# EAGLE design DCCShield (EAGLE 8.3.1)
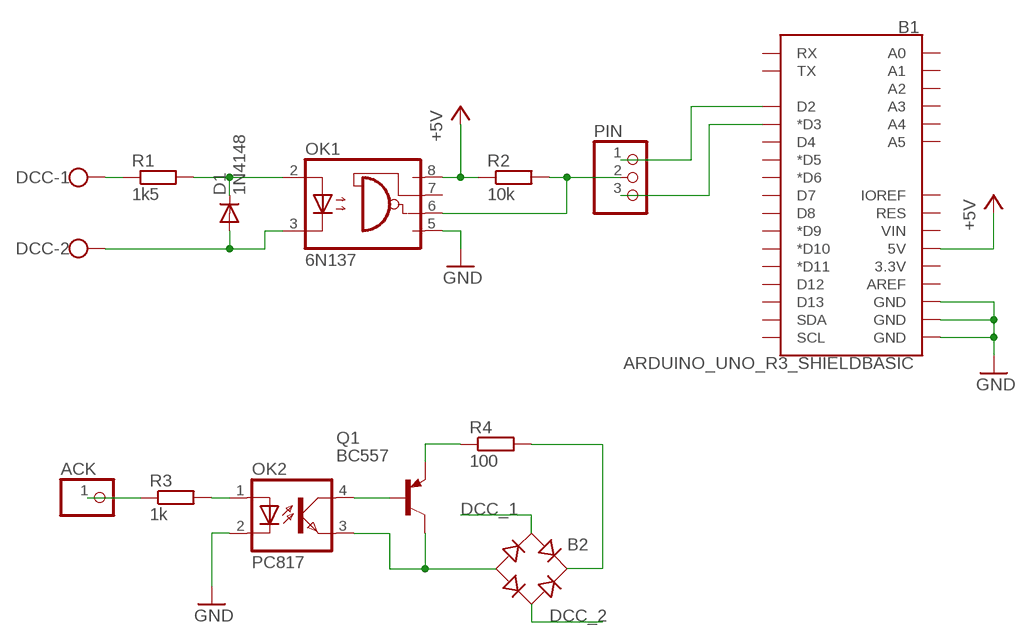
[diagram p0: schematic, sheet 1]

## Parts
ACK  PINHD-1X1  [1X01]
B1  ARDUINO_UNO_R3_SHIELDBASIC  [UNO_R3_SHIELD]
B2  RB1A  [RB1A]
D1  1N4148  1N4148DO35-10  [DO35-10]
DCC  W237-102  [W237-102]
OK1  6N137  [DIL08]
OK2  PC817  [DIL04]
PIN  PINHD-1X3  [1X03]
Q1  BC557  [TO92]
R1  1k5  R-EU_0207/10  [0207/10]
R2  10k  R-EU_0207/10  [0207/10]
R3  1k  R-EU_0207/10  [0207/10]
R4  100  R-EU_0207/10  [0207/10]

## Nets
+5V: B1.5V OK1.8(VCC) R2.1
DCC_1: B2.AC1 DCC.1 R1.1
DCC_2: B2.AC2 D1.A DCC.2 OK1.3(C)
GND: B1.GND@0(GND) B1.GND@1(GND) B1.GND@2(GND) OK1.5(GND) OK2.2(C)
N$1: B2.- OK2.3(EMIT) Q1.3(C)
N$2: D1.C OK1.2(A) R1.2
N$4: ACK.1 R3.1
N$5: OK1.6(VO) PIN.2 R2.2
N$6: B1.D2 PIN.1
N$7: B1.D3(*D3) PIN.3
N$8: OK2.1(A) R3.2
N$9: OK2.4(COL) Q1.2(B)
N$10: Q1.1(E) R4.1
N$11: B2.+ R4.2
Unconnected: B1.3.3V B1.A0 B1.A1 B1.A2 B1.A3 B1.A4 B1.A5 B1.AREF B1.D4 B1.D5(*D5) B1.D6(*D6) B1.D7 B1.D8 B1.D9(*D9) B1.D10(*D10) B1.D11(*D11) B1.D12 B1.D13 B1.IOREF B1.RES B1.RX B1.SCL B1.SDA B1.TX B1.VIN OK1.7(VE)

## Library data of the parts
ACK = pinhead:PINHD-1X1: PIN HEADER
B1 = SparkFun-Boards:ARDUINO_UNO_R3_SHIELD: Arduino R3 Shield Footprint Shield form compatible with the Arduino Uno R3. SparkFun Products: MG2639 Cellular Shield <https://www.sparkfun.com/products/13120> MIDI Shield <https://www.sparkfun.com/products/12898> R3 Stackable Headers Kit <https://www.sparkfun.com/products/11417>
B2 = rectifier:RB1A: RECTIFIER 1 A
D1 = diode:1N4148: DIODE high speed (Philips)
DCC = con-wago-500:W237-102: WAGO SCREW CLAMP; MPN: 237-102; OC_FARNELL: unknown; OC_NEWARK: 70K9898
OK1 = optocoupler:6N137: MOTOROLA OPTO COUPLER; MPN: 6N137; OC_FARNELL: 1328376; OC_NEWARK: 52M1895
OK2 = optocoupler:PC817: SHARP OPTO COUPLER; MPN: PC817X4J000F; OC_FARNELL: 9707727; OC_NEWARK: 97K7059
PIN = pinhead:PINHD-1X3: PIN HEADER
Q1 = transistor-pnp:BC557: PNP Transistor
R1-R4 = rcl:R-EU_: RESISTOR, European symbol

## Board
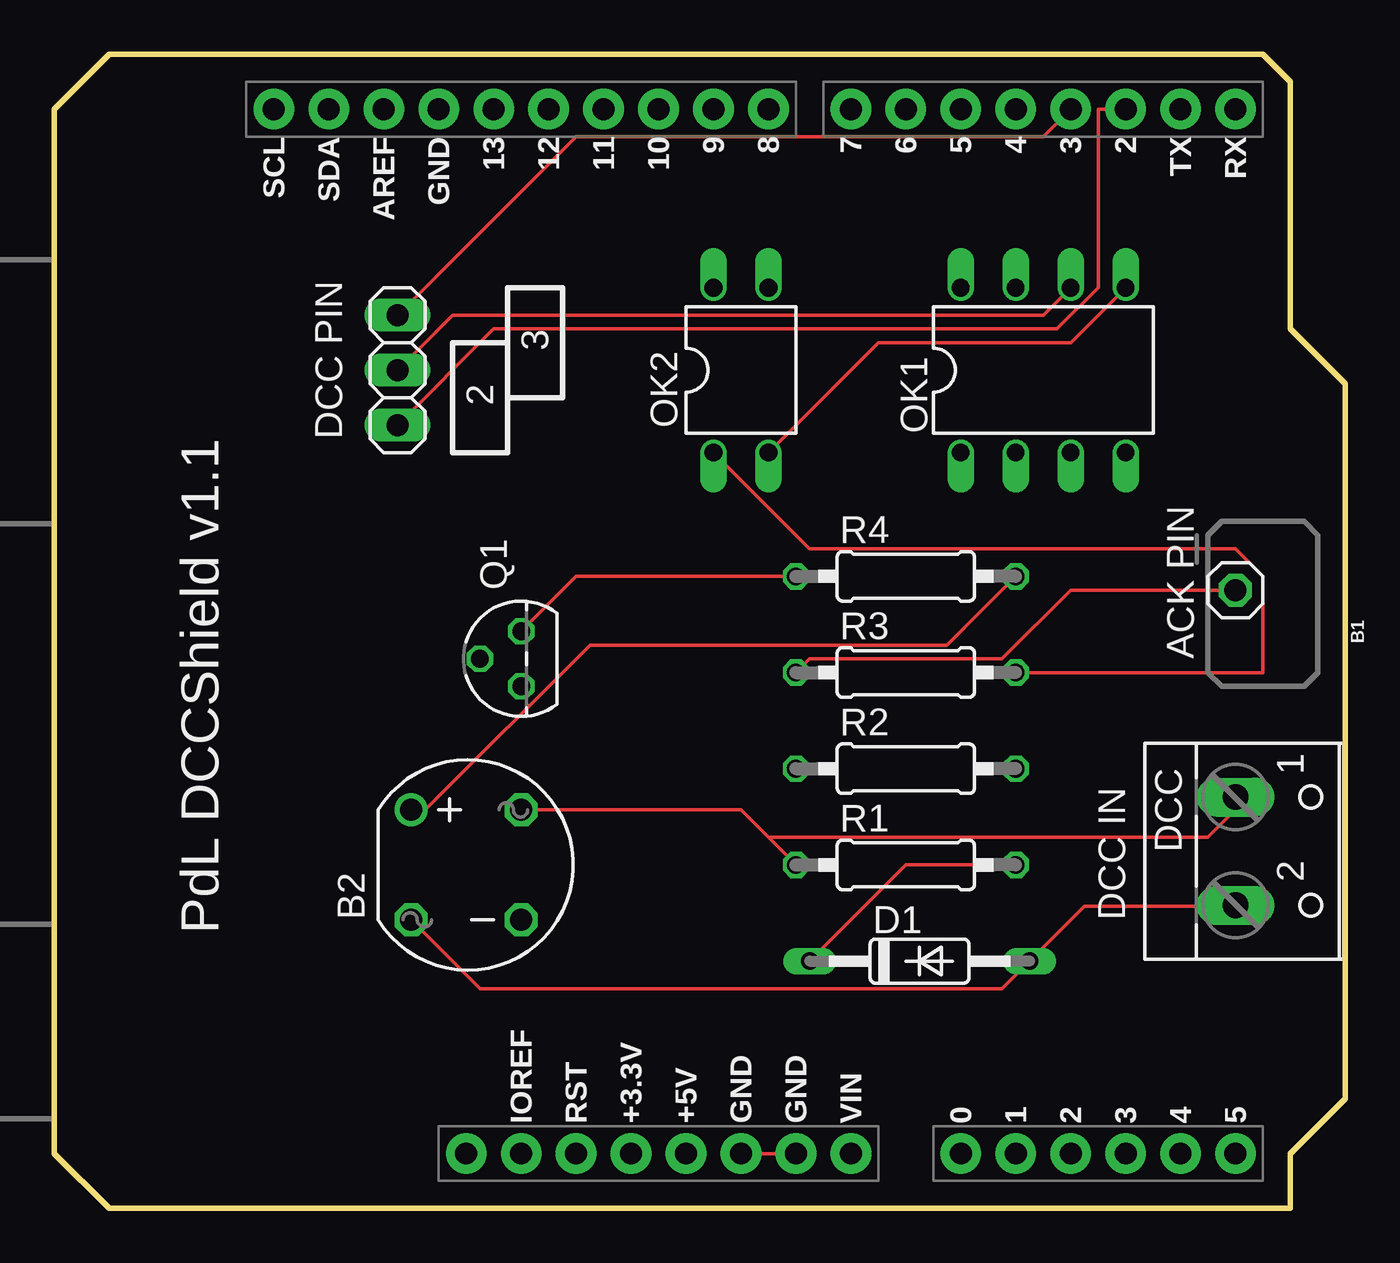
[diagram p1: board, top side]
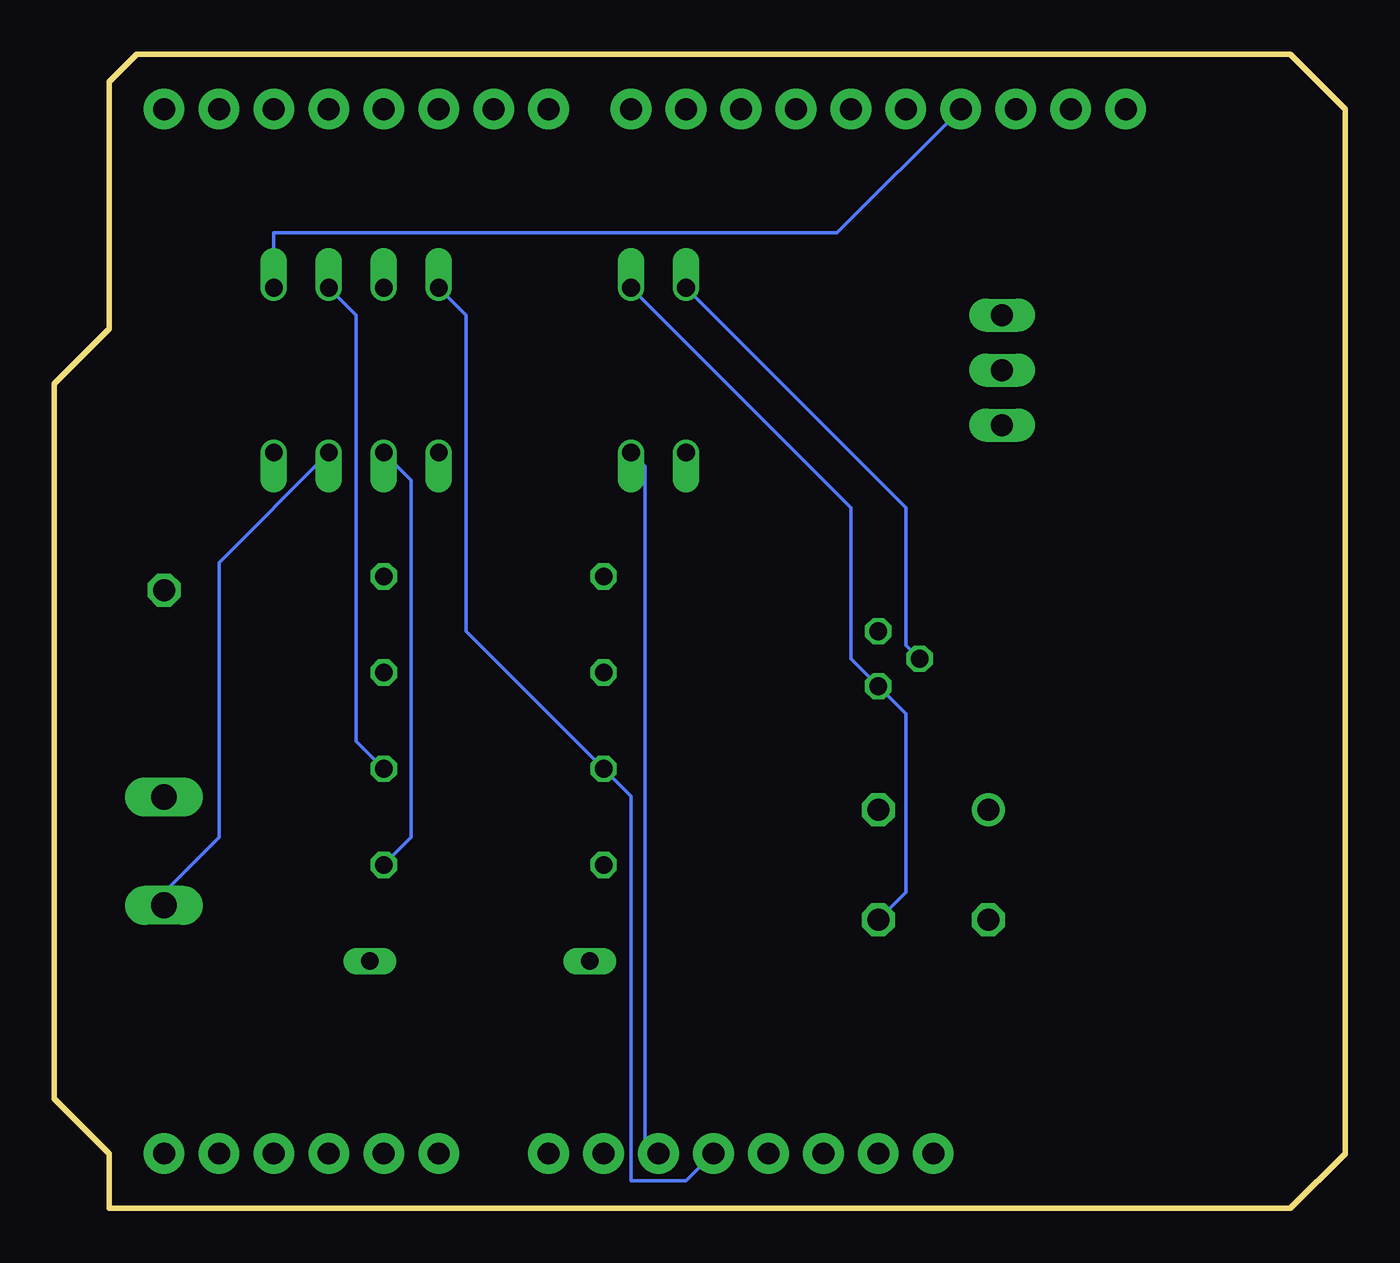
[diagram p2: board, bottom side, seen from below]

Size 59.69 x 53.34 mm. Coordinates in mm from the lower left corner, seen from the top.
Outline: 0,2.54 0,50.8 2.54,53.34 55.88,53.34 57.15,52.07 57.15,40.64 59.69,38.1 59.69,5.08 57.15,2.54 57.15,0 2.54,0 0,2.54
Copper layers (1*16): Top 0.035mm / dielectric 1.6mm / Bottom 0.035mm
Design rules "Elecrow_2-layer_PCB_eagle_rule": minimum track width 6mil, minimum drill 12mil, track to track 6mil, track to pad 8mil, pad to pad 12mil, via to via 12mil, smd to smd 0mil, copper to edge 20mil, drill to drill 10mil, minimum pad ring 6mil, minimum via ring 6mil, stop-mask expansion 0mil, vias tented up to drill 100mil, thermal gap 10mil

### Footprints (pad centres in the part's own frame; a part is rotated, then mirrored left to right if it is on the bottom)
1X01 = drill 1.016 octagon: 1 0,0
UNO_R3_SHIELD = drill 1.016 pad 1.88: 3.3V 24.13,-2.54; 5V 24.13,0; A0 24.13,12.7; A1 24.13,15.24; A2 24.13,17.78; A3 24.13,20.32; A4 24.13,22.86; A5 24.13,25.4; AREF -24.13,-13.97; D2 -24.13,20.32; D3 -24.13,17.78; D4 -24.13,15.24; D5 -24.13,12.7; D6 -24.13,10.16; D7 -24.13,7.62; D8 -24.13,3.81; D9 -24.13,1.27; D10 -24.13,-1.27; D11 -24.13,-3.81; D12 -24.13,-6.35; D13 -24.13,-8.89; GND@0 24.13,2.54; GND@1 24.13,5.08; GND@2 -24.13,-11.43; IOREF 24.13,-7.62; NC 24.13,-10.16; RES 24.13,-5.08; RX -24.13,25.4; SCL -24.13,-19.05; SDA -24.13,-16.51; TX -24.13,22.86; VIN 24.13,7.62
RB1A = drill 1.016: + -2.54,2.54 | drill 1.016 octagon: - 2.54,-2.54; AC1 2.54,2.54; AC2 -2.54,-2.54
DO35-10 = drill 0.813 long: A 5.08,0; C -5.08,0
W237-102 = drill 1.194 long: 1 -2.5,-1.27; 2 2.5,-1.27
DIL08 = drill 0.813 offset: 1 -3.81,-3.81; 2 -1.27,-3.81; 3 1.27,-3.81; 4 3.81,-3.81; 5 3.81,3.81; 6 1.27,3.81; 7 -1.27,3.81; 8 -3.81,3.81
DIL04 = drill 0.813 offset: 1 -1.27,-3.81; 2 1.27,-3.81; 3 1.27,3.81; 4 -1.27,3.81
1X03 = drill 1.016 long: 1 -2.54,0; 2 0,0; 3 2.54,0
TO92 = drill 0.813 octagon: 1 1.27,0; 2 0,1.905; 3 -1.27,0
0207/10 = drill 0.813 octagon: 1 -5.08,0; 2 5.08,0

### Placement (x,y rotation side)
ACK  54.61,28.57 90 top
B1  29.21,26.67 270 top
B2  19.05,15.88 0 top
D1  40.01,11.43 0 top
DCC  55.88,16.51 270 top
OK1  45.72,38.73 0 top
OK2  31.75,38.73 0 top
PIN  15.88,38.73 90 top
Q1  21.59,25.4 90 top
R1  39.37,15.88 0 top
R2  39.37,20.32 0 top
R3  39.37,24.77 0 top
R4  39.37,29.21 0 top

### Tracks (layer width: path | path; a pad name or v marks a point on that pad's centre or on a via)
+5V
  Bottom 0.152: OK1.8 40.64,41.27 40.64,26.67 R2.1 33.02,19.05 33.02,1.27 30.48,1.27 B1.5V
DCC_1
  Top 0.152: 33.02,17.14 31.75,18.41 B2.AC1 | 33.02,17.14 R1.1 | 33.02,17.14 53.34,17.14 54.61,18.41 DCC.1
DCC_2
  Top 0.152: DCC.2 54.61,13.97 47.62,13.97 D1.A 43.81,10.16 19.68,10.16 B2.AC2
  Bottom 0.152: OK1.3 52.07,29.84 52.07,17.14 54.61,14.61 DCC.2
GND
  Top 0.152: B1.GND@1 B1.GND@0 | OK2.2 38.1,40.01 46.99,40.01 OK1.5
  Bottom 0.152: B1.GND@2 23.5,45.09 49.53,45.09 OK1.5 | B1.GND@0 32.38,3.17 32.38,34.29 OK2.2
N$1
  Bottom 0.152: B2.- 20.32,14.61 20.32,22.86 Q1.3 22.86,25.4 22.86,32.38 OK2.3
N$2
  Top 0.152: D1.C 39.37,15.88 R1.2
  Bottom 0.152: OK1.2 43.18,33.66 43.18,17.14 R1.2
N$4
  Top 0.152: R3.1 34.92,25.4 43.81,25.4 46.99,28.57 ACK.1
N$5
  Top 0.152: PIN.2 18.41,41.27 45.72,41.27 OK1.6
  Bottom 0.152: R2.2 45.72,21.59 45.72,41.27 OK1.6
N$6
  Top 0.152: PIN.1 20.32,40.64 46.35,40.64 48.26,42.55 48.26,50.8 B1.D2
N$7
  Top 0.152: PIN.3 24.13,49.53 45.72,49.53 B1.D3
N$8
  Top 0.152: OK2.1 34.92,30.48 54.61,30.48 55.88,29.21 55.88,24.77 R3.2
N$9
  Bottom 0.152: Q1.2 20.32,26.04 20.32,32.38 OK2.4
N$10
  Top 0.152: Q1.1 24.13,29.21 R4.1
N$11
  Top 0.152: R4.2 41.27,26.04 24.77,26.04 17.14,18.41 B2.+

### Text on the board
tPlace: 3 | 2 | PdL DCCShield v1.1
tNames: DCC PIN | ACK PIN | DCC IN